# EAGLE design STM32F4 TFT-Proto Adapter FSMC (EAGLE 6.4)
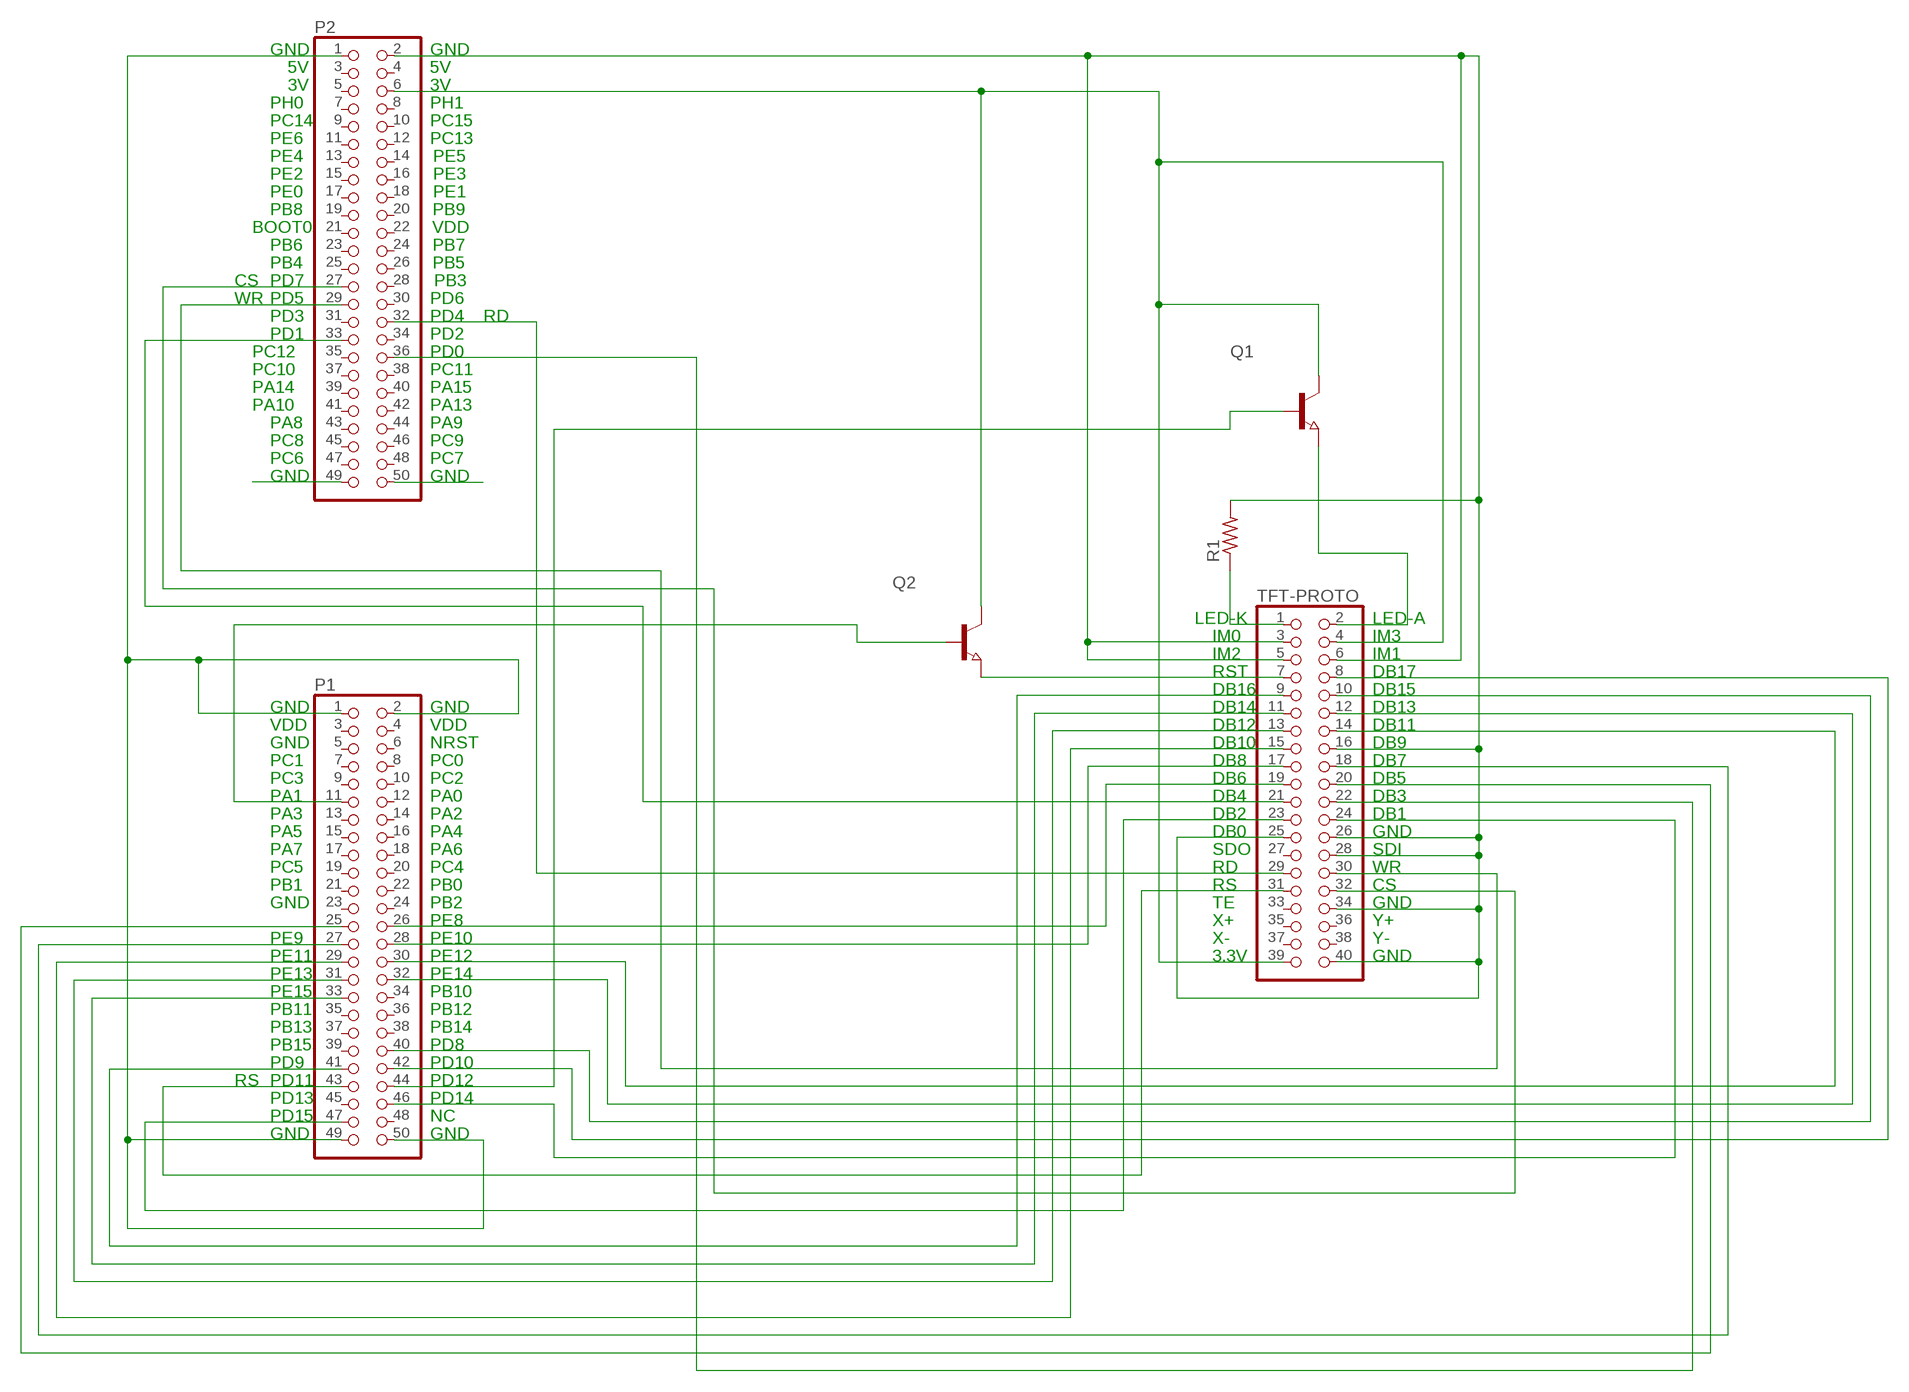
[diagram p0: schematic, sheet 1]

## Parts
P1  PINHD-2X25  [2X25]
P2  PINHD-2X25  [2X25]
Q1  NPN-TRANSISTOR_SOT23  [SOT23]
Q2  NPN-TRANSISTOR_SOT23  [SOT23]
R1  R-US_R0805  [R0805]
TFT-PROTO  PINHD-2X20  [2X20]

## Nets
CS: P2.27 TFT-PROTO.32
DB1: P1.46 TFT-PROTO.24
DB2: P1.47 TFT-PROTO.23
DB3: P2.36 TFT-PROTO.22
DB4: P2.33 TFT-PROTO.21
DB5: P1.25 TFT-PROTO.20
DB6: P1.26 TFT-PROTO.19
DB7: P1.27 TFT-PROTO.18
DB8: P1.28 TFT-PROTO.17
DB10: P1.29 TFT-PROTO.15
DB11: P1.30 TFT-PROTO.14
DB12: P1.31 TFT-PROTO.13
DB13: P1.32 TFT-PROTO.12
DB14: P1.33 TFT-PROTO.11
DB15: P1.40 TFT-PROTO.10
DB16: P1.41 TFT-PROTO.9
DB17: P1.42 TFT-PROTO.8
GND: P1.1 P1.2 P1.49 P1.50 P2.1 P2.2 P2.49 P2.50 R1.2 TFT-PROTO.3 TFT-PROTO.5 TFT-PROTO.6 TFT-PROTO.16 TFT-PROTO.25 TFT-PROTO.26 TFT-PROTO.28 TFT-PROTO.34 TFT-PROTO.40
N$1: P1.44 Q1.1(B)
N$3: R1.1 TFT-PROTO.1
N$4: Q1.2(E) TFT-PROTO.2
N$26: Q2.2(E) TFT-PROTO.7
PWR: P2.6 Q1.3(C) Q2.3(C) TFT-PROTO.4 TFT-PROTO.39
RD: P2.32 TFT-PROTO.29
RS: P1.43 TFT-PROTO.31
RST: P1.11 Q2.1(B)
WR: P2.29 TFT-PROTO.30
Unconnected: P1.3 P1.4 P1.5 P1.6 P1.7 P1.8 P1.9 P1.10 P1.12 P1.13 P1.14 P1.15 P1.16 P1.17 P1.18 P1.19 P1.20 P1.21 P1.22 P1.23 P1.24 P1.34 P1.35 P1.36 P1.37 P1.38 P1.39 P1.45 P1.48 P2.3 P2.4 P2.5 P2.7 P2.8 P2.9 P2.10 P2.11 P2.12 P2.13 P2.14 P2.15 P2.16 P2.17 P2.18 P2.19 P2.20 P2.21 P2.22 P2.23 P2.24 P2.25 P2.26 P2.28 P2.30 P2.31 P2.34 P2.35 P2.37 P2.38 P2.39 P2.40 P2.41 P2.42 P2.43 P2.44 P2.45 P2.46 P2.47 P2.48 TFT-PROTO.27 TFT-PROTO.33 TFT-PROTO.35 TFT-PROTO.36 TFT-PROTO.37 TFT-PROTO.38

## Notes on the sheet
- GND | GND
- 5V | 5V
- 3V | 3V
- PH0 | PH1
- PC14 | PC15
- PE6 | PC13
- PE4                          PE5
- PE2                          PE3
- PE0                          PE1
- PB8                          PB9
- BOOT0                        VDD
- PB6                          PB7
- PB4                          PB5
- CS | PD7                          PB3
- WR | PD5 | PD6
- PD3 | PD4 | RD
- PD1 | PD2
- PC12 | PD0
- PC10 | PC11
- PA14 | PA15
- PA10 | PA13
- PA8 | PA9
- PC8 | PC9
- PC6 | PC7
- GND | GND
- LED-K | LED-A
- IM0 | IM3
- IM2 | IM1
- RST | DB17
- DB16 | DB15
- GND | GND | DB14 | DB13
- VDD | VDD | DB12 | DB11
- GND | NRST | DB10 | DB9
- PC1 | PC0 | DB8 | DB7
- PC3 | PC2 | DB6 | DB5
- PA1 | PA0 | DB4 | DB3
- PA3 | PA2 | DB2 | DB1
- PA5 | PA4 | DB0 | GND
- PA7 | PA6 | SDO | SDI
- PC5 | PC4 | RD | WR
- PB1 | PB0 | RS | CS
- GND | PB2 | TE | GND
- PE7 | PE8 | X+ | Y+
- PE9 | PE10 | X- | Y-
- PE11 | PE12 | 3.3V | GND
- PE13 | PE14
- PE15 | PB10
- PB11 | PB12
- PB13 | PB14
- PB15 | PD8
- PD9 | PD10
- RS | PD11 | PD12
- PD13 | PD14
- PD15 | NC
- GND | GND

## Library data of the parts
P1 P2 = pinhead:PINHD-2X25: PIN HEADER
Q1 Q2 = semicon-smd-ipc:NPN-TRANSISTOR_: NPN TRANSISTOR
R1 = resistor:R-US_: RESISTOR, American symbol
TFT-PROTO = pinhead:PINHD-2X20: PIN HEADER

## Board
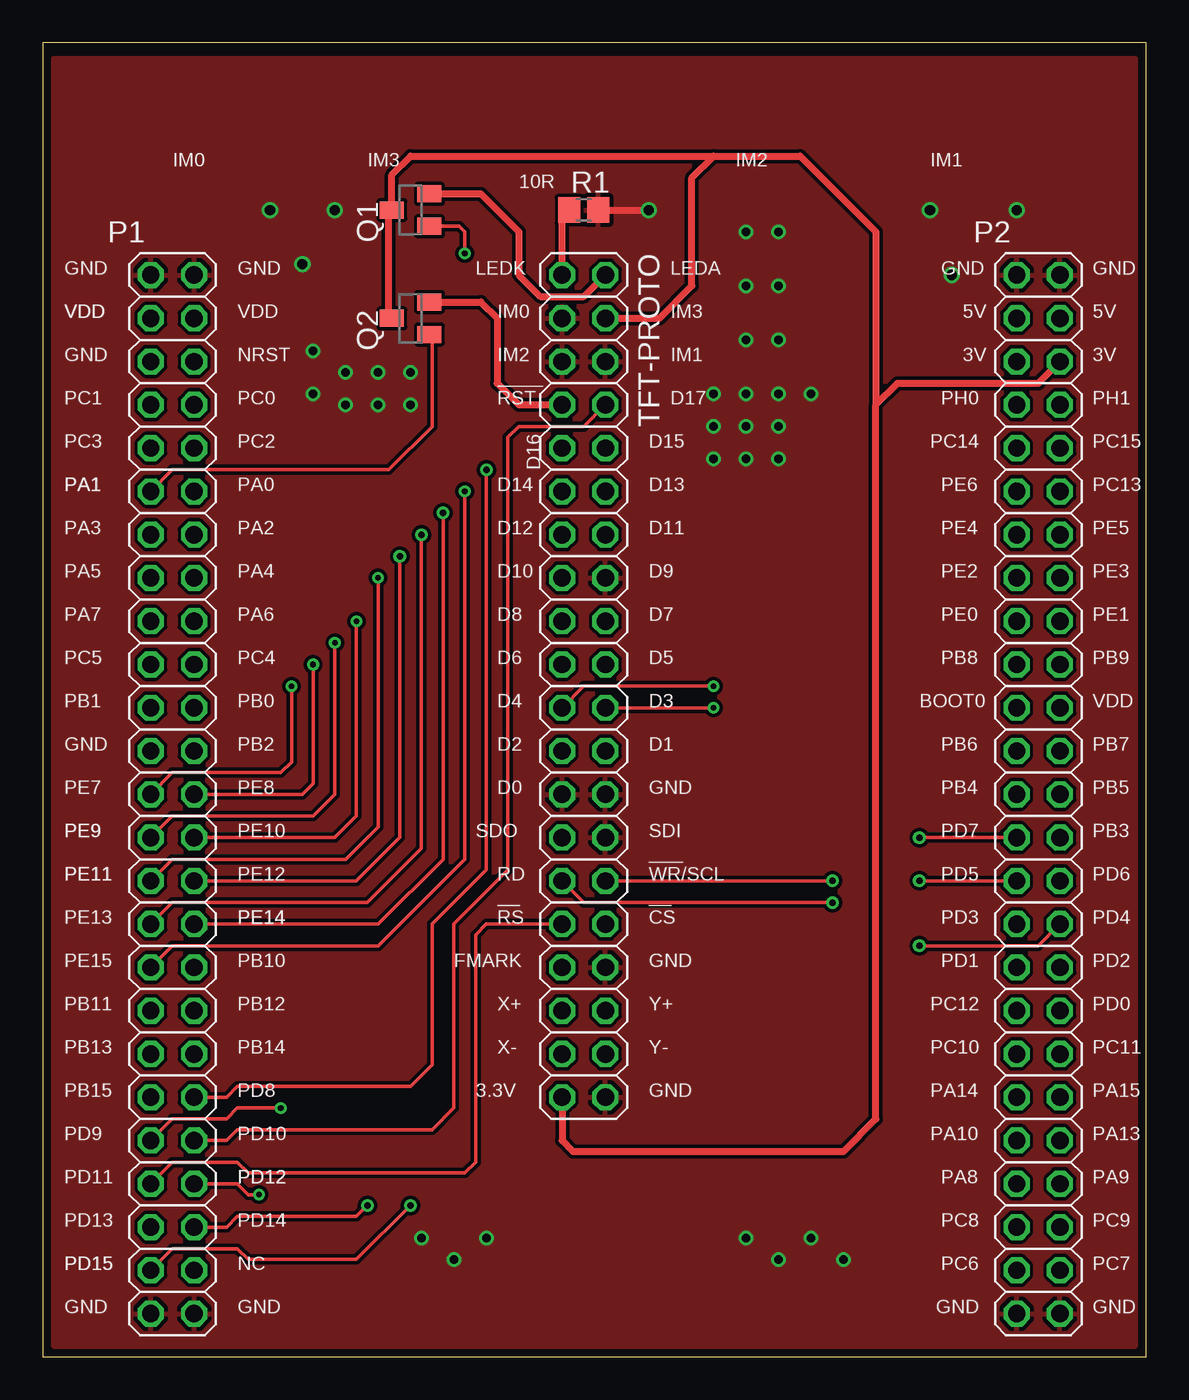
[diagram p1: board, top side]
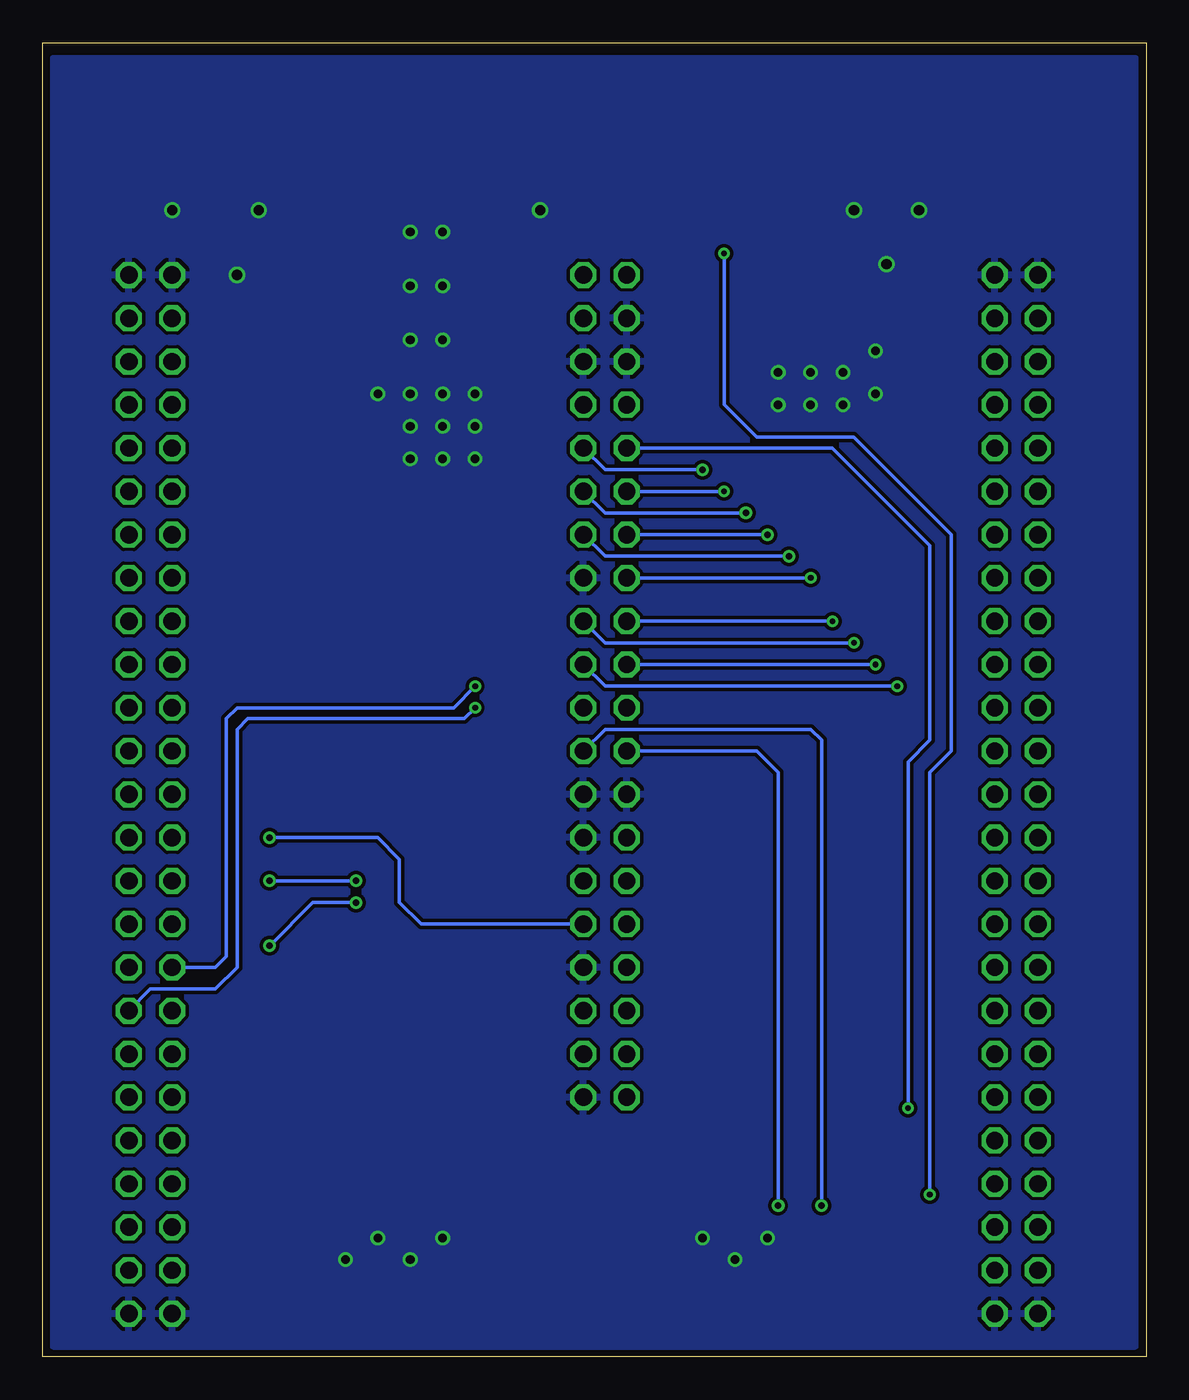
[diagram p2: board, bottom side, seen from below]

Size 64.75 x 77.14 mm. Coordinates in mm from the lower left corner, seen from the top.
Outline: 0,0 64.75,0 64.75,77.14 0,77.14 0,0
Copper layers (1*16): Top 0.0356mm / dielectric 1.5011mm / Bottom 0.0356mm
Design rules "LaenPCBOrder *": minimum track width 6mil, minimum drill 13mil, track to track 8mil, track to pad 8mil, pad to pad 8mil, via to via 8mil, smd to smd 8mil, copper to edge 15mil, drill to drill 6mil, minimum pad ring 7mil, minimum via ring 7mil, stop-mask expansion 4mil, vias tented up to drill 0mil, thermal gap 10mil

### Footprints (pad centres in the part's own frame; a part is rotated, then mirrored left to right if it is on the bottom)
2X25 = drill 1.016 octagon: 1 -30.48,-1.27; 2 -30.48,1.27; 3 -27.94,-1.27; 4 -27.94,1.27; 5 -25.4,-1.27; 6 -25.4,1.27; 7 -22.86,-1.27; 8 -22.86,1.27; 9 -20.32,-1.27; 10 -20.32,1.27; 11 -17.78,-1.27; 12 -17.78,1.27; 13 -15.24,-1.27; 14 -15.24,1.27; 15 -12.7,-1.27; 16 -12.7,1.27; 17 -10.16,-1.27; 18 -10.16,1.27; 19 -7.62,-1.27; 20 -7.62,1.27; 21 -5.08,-1.27; 22 -5.08,1.27; 23 -2.54,-1.27; 24 -2.54,1.27; 25 0,-1.27; 26 0,1.27; 27 2.54,-1.27; 28 2.54,1.27; 29 5.08,-1.27; 30 5.08,1.27; 31 7.62,-1.27; 32 7.62,1.27; 33 10.16,-1.27; 34 10.16,1.27; 35 12.7,-1.27; 36 12.7,1.27; 37 15.24,-1.27; 38 15.24,1.27; 39 17.78,-1.27; 40 17.78,1.27; 41 20.32,-1.27; 42 20.32,1.27; 43 22.86,-1.27; 44 22.86,1.27; 45 25.4,-1.27; 46 25.4,1.27; 47 27.94,-1.27; 48 27.94,1.27; 49 30.48,-1.27; 50 30.48,1.27
SOT23 = smd 1 x 1.4: 1 -0.95,-1.1; 2 0.95,-1.1; 3 0,1.1
R0805 = smd 1.3 x 1.5: 1 -0.85,0; 2 0.85,0
2X20 = drill 1.016 octagon: 1 -24.13,-1.27; 2 -24.13,1.27; 3 -21.59,-1.27; 4 -21.59,1.27; 5 -19.05,-1.27; 6 -19.05,1.27; 7 -16.51,-1.27; 8 -16.51,1.27; 9 -13.97,-1.27; 10 -13.97,1.27; 11 -11.43,-1.27; 12 -11.43,1.27; 13 -8.89,-1.27; 14 -8.89,1.27; 15 -6.35,-1.27; 16 -6.35,1.27; 17 -3.81,-1.27; 18 -3.81,1.27; 19 -1.27,-1.27; 20 -1.27,1.27; 21 1.27,-1.27; 22 1.27,1.27; 23 3.81,-1.27; 24 3.81,1.27; 25 6.35,-1.27; 26 6.35,1.27; 27 8.89,-1.27; 28 8.89,1.27; 29 11.43,-1.27; 30 11.43,1.27; 31 13.97,-1.27; 32 13.97,1.27; 33 16.51,-1.27; 34 16.51,1.27; 35 19.05,-1.27; 36 19.05,1.27; 37 21.59,-1.27; 38 21.59,1.27; 39 24.13,-1.27; 40 24.13,1.27

### Placement (x,y rotation side)
P1  7.62,33.02 270 top
P2  58.42,33.02 270 top
Q1  21.59,67.31 90 top
Q2  21.59,60.96 90 top
R1  31.75,67.31 0 top
TFT-PROTO  31.75,39.37 270 top

### Tracks (layer width: path | path; a pad name or v marks a point on that pad's centre or on a via)
CS  (via drill 0.38)
  Top 0.203: P2.27 v51.44,30.48
  Bottom 0.203: v51.44,30.48 45.09,30.48 43.82,29.21 43.82,26.67 42.55,25.4 TFT-PROTO.32
DB1  (via drill 0.38)
  Top 0.203: P1.46 10.79,7.62 11.43,8.26 18.41,8.26 v19.05,8.89
  Bottom 0.203: v19.05,8.89 19.05,36.2 19.68,36.83 31.75,36.83 TFT-PROTO.24
DB2  (via drill 0.38)
  Top 0.203: P1.47 7.62,6.35 11.43,6.35 12.07,5.71 18.41,5.71 v21.59,8.89
  Bottom 0.203: v21.59,8.89 21.59,34.29 22.86,35.56 TFT-PROTO.23
DB3  (via drill 0.33)
  Top 0.203: v39.37,38.1 TFT-PROTO.22
  Bottom 0.203: P2.36 58.42,21.59 54.61,21.59 53.34,22.86 53.34,36.83 52.71,37.47 40.01,37.47 v39.37,38.1
DB4  (via drill 0.33)
  Top 0.203: v39.37,39.37 31.75,39.37 TFT-PROTO.21
  Bottom 0.203: P2.33 54.61,22.86 53.98,23.5 53.98,37.47 53.34,38.1 40.64,38.1 v39.37,39.37
DB5  (via drill 0.33)
  Top 0.203: P1.25 7.62,34.29 13.97,34.29 14.61,34.92 v14.61,39.37
  Bottom 0.203: v14.61,39.37 31.75,39.37 TFT-PROTO.20
DB6  (via drill 0.33)
  Top 0.203: P1.26 15.24,33.02 15.88,33.66 v15.88,40.64
  Bottom 0.203: v15.88,40.64 TFT-PROTO.19
DB7  (via drill 0.33)
  Top 0.203: P1.27 7.62,31.75 15.88,31.75 17.14,33.02 v17.14,41.91
  Bottom 0.203: v17.14,41.91 31.75,41.91 TFT-PROTO.18
DB8  (via drill 0.33)
  Top 0.203: P1.28 17.14,30.48 18.41,31.75 v18.41,43.18
  Bottom 0.203: v18.41,43.18 TFT-PROTO.17
DB10  (via drill 0.33)
  Top 0.203: P1.29 7.62,29.21 17.78,29.21 19.68,31.11 v19.68,45.72
  Bottom 0.203: v19.68,45.72 TFT-PROTO.15
DB11  (via drill 0.38)
  Top 0.203: P1.30 18.41,27.94 20.95,30.48 v20.95,46.99
  Bottom 0.203: v20.95,46.99 31.75,46.99 TFT-PROTO.14
DB12  (via drill 0.38)
  Top 0.203: P1.31 7.62,26.67 19.05,26.67 22.22,29.84 v22.22,48.26
  Bottom 0.203: v22.22,48.26 TFT-PROTO.13
DB13  (via drill 0.38)
  Top 0.203: P1.32 19.68,25.4 23.49,29.21 v23.49,49.53
  Bottom 0.203: v23.49,49.53 31.75,49.53 TFT-PROTO.12
DB14  (via drill 0.33)
  Top 0.203: v24.76,50.8 24.76,29.21 19.68,24.13 7.62,24.13 P1.33
  Bottom 0.203: TFT-PROTO.11 v24.76,50.8
DB15  (via drill 0.38)
  Top 0.203: P1.40 10.79,15.24 11.43,15.88 21.59,15.88 22.86,17.14 22.86,25.4 26.04,28.57 v26.04,52.07
  Bottom 0.203: v26.04,52.07 31.75,52.07 TFT-PROTO.10
DB16  (via drill 0.33)
  Top 0.203: P1.41 7.62,13.97 10.79,13.97 11.43,14.61 v13.97,14.61
  Bottom 0.203: TFT-PROTO.9 18.41,53.34 12.7,47.62 12.7,36.2 13.97,34.92 v13.97,14.61
DB17
  Top 0.203: P1.42 10.79,12.7 11.43,13.34 22.86,13.34 24.13,14.61 24.13,25.4 27.3,28.57 27.3,53.98 27.94,54.61 31.75,54.61 TFT-PROTO.8
GND  (via drill 0.5, 0.6)
  Top 0.406: R1.2 v35.56,67.31
  other vias: 43.18,66.04 43.18,62.87 22.22,6.99 24.13,5.71 26.04,6.99 41.28,6.99 43.18,5.71 45.09,6.99 46.99,5.71 41.28,62.87 43.18,59.69 41.28,59.69 41.28,66.04 43.18,56.52 41.28,56.52 17.78,55.88 19.68,55.88 21.59,55.88 15.88,56.52 15.88,59.05 17.78,57.78 19.68,57.78 21.59,57.78 43.18,52.7 43.18,54.61 41.28,52.7 41.28,54.61 45.09,56.52 39.37,52.7 39.37,54.61 39.37,56.52 13.34,67.31 15.24,64.14 17.14,67.31 52.07,67.31 57.15,67.31 53.34,63.5
  pour Bottom: 0.64,76.2 64.14,76.2 64.14,0.64 0.64,0.64
  pour Top: 0.64,76.2 0.64,0.64 64.14,0.64 64.14,76.2
N$1  (via drill 0.33)
  Top 0.203: P1.44 11.43,10.16 12.07,9.53 v12.7,9.53 | Q1.1 24.45,66.36 24.76,66.04 v24.76,64.77
  Bottom 0.203: v24.76,64.77 24.76,55.88 22.86,53.98 17.14,53.98 11.43,48.26 11.43,35.56 12.7,34.29 v12.7,9.53
N$3
  Top 0.406: TFT-PROTO.1 30.48,66.89 R1.1
N$4
  Top 0.406: Q1.2 25.72,68.26 27.94,66.04 27.94,63.5 29.21,62.23 31.75,62.23 TFT-PROTO.2
N$26
  Top 0.406: Q2.2 25.72,61.91 26.67,60.96 26.67,57.15 27.94,55.88 TFT-PROTO.7
PWR
  Top 0.406: Q1.3 20.32,67.31 | TFT-PROTO.39 30.48,12.7 31.11,12.06 46.99,12.06 48.9,13.97 48.9,55.88 | 48.9,55.88 50.16,57.15 58.42,57.15 P2.6 | 48.9,55.88 48.9,66.04 44.45,70.48 39.37,70.48 | Q2.3 20.32,60.96 20.32,67.14 Q1.3 | Q1.3 20.49,69.39 21.59,70.48 39.37,70.48 | TFT-PROTO.4 36.2,60.96 38.1,62.87 38.1,69.22 39.37,70.48
RD  (via drill 0.38)
  Top 0.203: TFT-PROTO.29 31.75,26.67 v46.36,26.67 | v51.44,24.13 58.42,24.13 P2.32
  Bottom 0.203: v46.36,26.67 48.9,26.67 v51.44,24.13
RS
  Top 0.203: TFT-PROTO.31 26.04,25.4 25.4,24.77 25.4,11.43 24.76,10.79 12.07,10.79 11.43,11.43 7.62,11.43 P1.43
RST
  Top 0.203: P1.11 7.62,52.07 20.32,52.07 22.86,54.61 22.86,59.84 Q2.1
WR  (via drill 0.38)
  Top 0.203: P2.29 v51.44,27.94 | v46.36,27.94 TFT-PROTO.30
  Bottom 0.203: v51.44,27.94 v46.36,27.94

### Text on the board
tPlace: IM0 | IM3 | IM2 | IM1 | GND
tNames: 10R | GND | GND | LEDK | LEDA | GND | GND | VDD | VDD | VDD | IM0 | IM3 | 5V | 5V | GND | NRST | IM2 | IM1 | 3V | 3V | ____ | PC1 | PC0 | RST | D17 | PH0 | PH1 | PC3 | PC2 | D15 | PC14 | PC15 | D16 | PA1 | PA1 | PA0 | D14 | D13 | PE6 | PC13 | PA3 | PA2 | D12 | D11 | PE4 | PE5 | PA5 | PA4 | D10 | D9 | PE2 | PE3 | PA7 | PA6 | D8 | D7 | PE0 | PE1 | PC5 | PC4 | D6 | D5 | PB8 | PB9 | PB1 | PB0 | D4 | D3 | BOOT0 | VDD | GND | PB2 | D2 | D1 | PB6 | PB7 | PE7 | PE8 | D0 | GND | PB4 | PB5 | PE9 | PE9 | PE10 | SDO | SDI | PD7 | PB3 | ___ | PE11 | PE11 | PE12 | RD | WR/SCL | PD5 | PD6 | __ | __ | PE13 | PE14 | PE14 | RS | CS | PD3 | PD4 | PE15 | PB10 | FMARK | GND | PD1 | PD2 | PB11 | PB12 | X+ | Y+ | PC12 | PD0 | PB13 | PB14 | X- | Y- | PC10 | PC11 | PB15 | PD8 | 3.3V | PA14 | PA15 | PD9 | PD10 | PA10 | PA13 | PD11 | PD12 | PD12 | PA8 | PA9 | PD13 | PD14 | PC8 | PC9 | PD15 | PD15 | NC | PC6 | PC7 | GND | GND | GND | GND